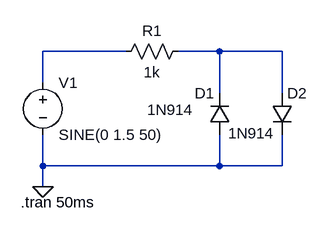
[diagram p0: schematic Draft4.asc]
Draft4.asc, the LTspice schematic file:
Version 4
SHEET 1 880 680
WIRE 192 48 64 48
WIRE 336 48 272 48
WIRE 432 48 336 48
WIRE 64 96 64 48
WIRE 336 112 336 48
WIRE 432 112 432 48
WIRE 64 224 64 176
WIRE 336 224 336 176
WIRE 336 224 64 224
WIRE 432 224 432 176
WIRE 432 224 336 224
WIRE 64 256 64 224
FLAG 64 256 0
SYMBOL voltage 64 80 R0
WINDOW 123 0 0 Left 0
WINDOW 39 0 0 Left 0
SYMATTR InstName V1
SYMATTR Value SINE(0 1.5 50)
SYMBOL res 288 32 R90
WINDOW 0 0 56 VBottom 2
WINDOW 3 32 56 VTop 2
SYMATTR InstName R1
SYMATTR Value 1k
SYMBOL diode 352 176 R180
WINDOW 0 24 64 Left 2
WINDOW 3 56 38 Left 2
SYMATTR InstName D1
SYMATTR Value 1N914
SYMBOL diode 416 112 R0
WINDOW 3 -67 62 Left 2
SYMATTR InstName D2
SYMATTR Value 1N914
TEXT 30 280 Left 2 !.tran 50ms

The netlist it stands for:
* Draft4.asc
V1 N001 0 SINE(0 1.5 50)
R1 N002 N001 1k
D1 0 N002 1N914
D2 N002 0 1N914
.model D D
.lib standard.dio
.tran 50ms
.backanno
.end